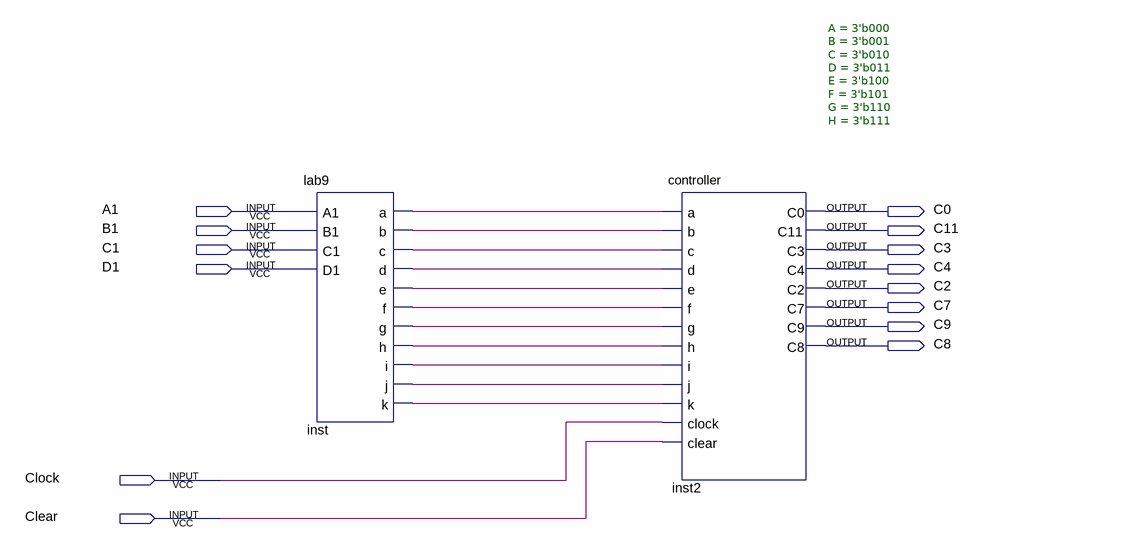
[diagram p0: schematic sheet]
// Quartus schematic lab9final.bdf as structural Verilog: 2 symbols, 14 pins
module lab9final (
  input  A1,
  input  B1,
  input  C1,
  input  D1,
  input  Clock,
  input  Clear,
  output C0,
  output C11,
  output C3,
  output C4,
  output C2,
  output C7,
  output C9,
  output C8
);

  wire inst_a, inst_b, inst_c, inst_d, inst_e, inst_f, inst_g, inst_h, inst_i, inst_j, inst_k;

  lab9 inst (
    .A1(A1), .B1(B1), .C1(C1), .D1(D1), .a(inst_a), .b(inst_b), .c(inst_c), .d(inst_d), .e(inst_e),
    .f(inst_f), .g(inst_g), .h(inst_h), .i(inst_i), .j(inst_j), .k(inst_k));
  controller #(.A(3'b000), .B(3'b001), .C(3'b010), .D(3'b011), .E(3'b100), .F(3'b101), .G(3'b110), .H(3'b111)) inst2 (
    .a(inst_a), .b(inst_b), .c(inst_c), .d(inst_d), .e(inst_e), .f(inst_f), .g(inst_g), .h(inst_h),
    .i(inst_i), .j(inst_j), .k(inst_k), .clock(Clock), .clear(Clear), .C0(C0), .C11(C11), .C3(C3), .C4(C4),
    .C2(C2), .C7(C7), .C9(C9), .C8(C8));
endmodule
